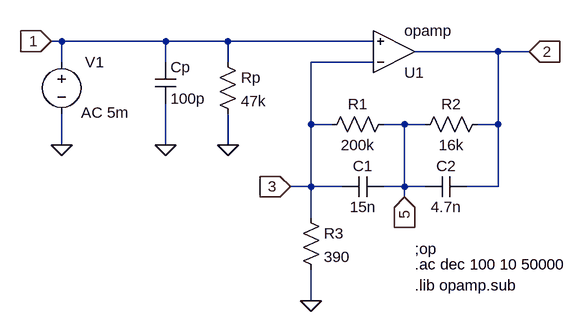
[diagram p0: schematic LM4562 Preamp.asc]
LM4562 Preamp.asc, the LTspice schematic file:
Version 4
SHEET 1 1876 1124
WIRE -272 176 -288 176
WIRE -112 176 -272 176
WIRE -16 176 -112 176
WIRE 208 176 -16 176
WIRE 400 192 272 192
WIRE 448 192 400 192
WIRE -272 208 -272 176
WIRE -112 208 -112 176
WIRE -16 208 -16 176
WIRE 208 208 112 208
WIRE 112 304 112 208
WIRE 144 304 112 304
WIRE 256 304 224 304
WIRE 288 304 256 304
WIRE 400 304 400 192
WIRE 400 304 368 304
WIRE -272 336 -272 288
WIRE -112 336 -112 272
WIRE -16 336 -16 288
WIRE 112 400 112 304
WIRE 112 400 80 400
WIRE 160 400 112 400
WIRE 256 400 256 304
WIRE 256 400 224 400
WIRE 288 400 256 400
WIRE 400 400 400 304
WIRE 400 400 352 400
WIRE 256 416 256 400
WIRE 112 448 112 400
WIRE 112 576 112 528
FLAG -272 336 0
FLAG 112 576 0
FLAG -288 176 1
IOPIN -288 176 In
FLAG 80 400 3
IOPIN 80 400 In
FLAG 256 416 5
IOPIN 256 416 In
FLAG -112 336 0
FLAG -16 336 0
FLAG 448 192 2
IOPIN 448 192 In
SYMBOL voltage -272 192 R0
WINDOW 3 24 44 Left 2
WINDOW 123 30 94 Left 2
WINDOW 0 36 16 Left 2
WINDOW 39 0 0 Left 2
SYMATTR Value ""
SYMATTR Value2 AC 5m
SYMATTR InstName V1
SYMBOL cap 160 416 R270
WINDOW 0 32 32 VTop 2
WINDOW 3 0 32 VBottom 2
SYMATTR InstName C1
SYMATTR Value 15n
SYMBOL res 96 432 R0
SYMATTR InstName R3
SYMATTR Value 390
SYMBOL res 128 320 R270
WINDOW 0 32 56 VTop 2
WINDOW 3 0 56 VBottom 2
SYMATTR InstName R1
SYMATTR Value 200k
SYMBOL res 272 320 R270
WINDOW 0 32 56 VTop 2
WINDOW 3 0 56 VBottom 2
SYMATTR InstName R2
SYMATTR Value 16k
SYMBOL cap -128 208 R0
SYMATTR InstName Cp
SYMATTR Value 100p
SYMBOL res -32 192 R0
SYMATTR InstName Rp
SYMATTR Value 47k
SYMBOL OpAmps\\opamp 240 256 M180
SYMATTR InstName U1
SYMBOL cap 288 416 R270
WINDOW 0 32 32 VTop 2
WINDOW 3 0 32 VBottom 2
SYMATTR InstName C2
SYMATTR Value 4.7n
TEXT 272 496 Left 2 !;op
TEXT 272 520 Left 2 !.ac dec 100 10 50000
TEXT 272 552 Left 2 !.lib opamp.sub

The netlist it stands for:
* LM4562 Preamp.asc
V1 1 0 AC 5m
C1 3 5 15n
R3 3 0 390
R1 3 5 200k
R2 5 2 16k
Cp 1 0 100p
Rp 1 0 47k
XU1 3 1 2 opamp Aol=100K GBW=10Meg  ; pins invin noninvin out
C2 5 2 4.7n
;op
.ac dec 100 10 50000
.lib opamp.sub
.backanno
.end